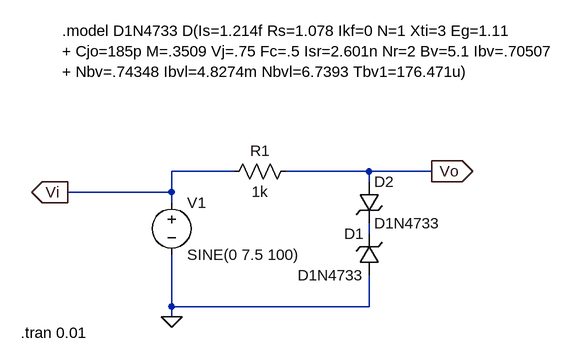
[diagram p0: schematic Simu_B_b.asc]
Simu_B_b.asc, the LTspice schematic file:
Version 4.1
SHEET 1 880 680
WIRE 176 48 80 48
WIRE 384 48 256 48
WIRE 480 48 384 48
WIRE 384 64 384 48
WIRE 80 80 80 48
WIRE 80 80 -80 80
WIRE 80 96 80 80
WIRE 384 144 384 128
WIRE 80 256 80 176
WIRE 384 256 384 208
WIRE 384 256 80 256
WIRE 80 272 80 256
FLAG 80 272 0
FLAG 480 48 Vo
IOPIN 480 48 Out
FLAG -80 80 Vi
IOPIN -80 80 Out
SYMBOL lib\\sym\\zener 368 64 R0
SYMATTR InstName D2
SYMATTR Value D1N4733
SYMBOL res 272 32 R90
WINDOW 0 0 56 VBottom 2
WINDOW 3 32 56 VTop 2
SYMATTR InstName R1
SYMATTR Value 1k
SYMBOL lib\\sym\\zener 400 208 R180
WINDOW 0 24 64 Left 2
WINDOW 3 24 0 Left 2
SYMATTR InstName D1
SYMATTR Value D1N4733
SYMBOL voltage 80 80 R0
WINDOW 123 0 0 Left 0
WINDOW 39 0 0 Left 0
SYMATTR InstName V1
SYMATTR Value SINE(0 7.5 100)
TEXT -88 -168 Left 2 !.model D1N4733 D(Is=1.214f Rs=1.078 Ikf=0 N=1 Xti=3 Eg=1.11\n+ Cjo=185p M=.3509 Vj=.75 Fc=.5 Isr=2.601n Nr=2 Bv=5.1 Ibv=.70507\n+ Nbv=.74348 Ibvl=4.8274m Nbvl=6.7393 Tbv1=176.471u)
TEXT -152 296 Left 2 !.tran 0.01

The netlist it stands for:
* Simu_B_b.asc
D2 Vo N001 D1N4733
R1 Vo Vi 1k
D1 0 N001 D1N4733
V1 Vi 0 SINE(0 7.5 100)
.model D D
.lib standard.dio
.model D1N4733 D(Is=1.214f Rs=1.078 Ikf=0 N=1 Xti=3 Eg=1.11
+ Cjo=185p M=.3509 Vj=.75 Fc=.5 Isr=2.601n Nr=2 Bv=5.1 Ibv=.70507
+ Nbv=.74348 Ibvl=4.8274m Nbvl=6.7393 Tbv1=176.471u)
.tran 0.01
.backanno
.end

* Results of the author's LTspice run, read from the files saved beside the schematic
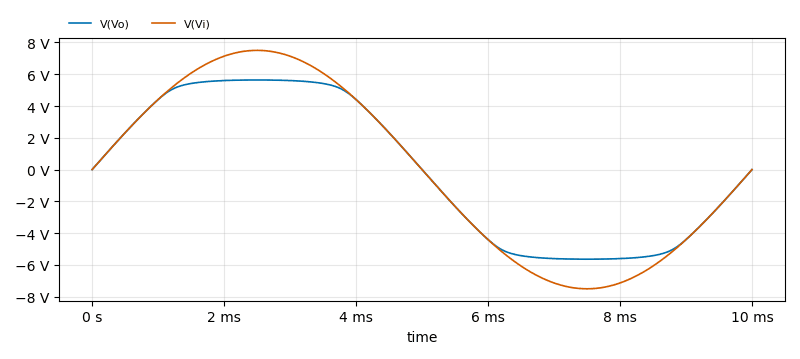
[diagram p1: Transient Analysis of Simu_B_b.asc, plotted from the saved traces]
* Transient Analysis, 1 run:
*   V(Vo): min -5.637 V, max 5.637 V, average -18.26 µV, rms 4.505 V, last -309.9 µV
*   V(Vi): min -7.5 V, max 7.5 V, average 0 V, rms 5.303 V, last 0 V